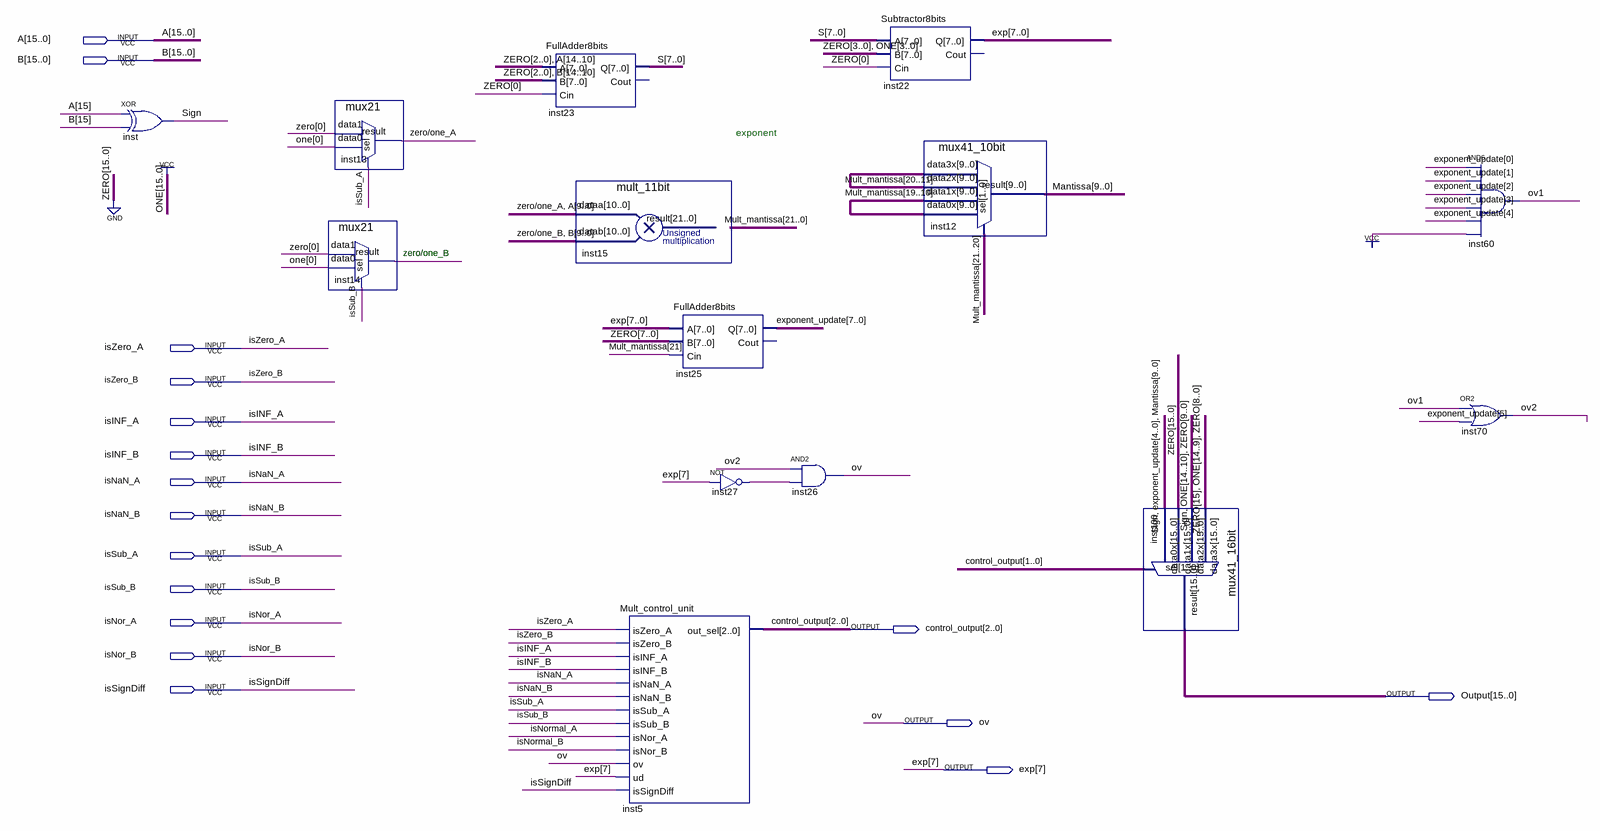
[diagram p0: schematic sheet]
// Quartus schematic Multiplies.bdf as structural Verilog: 14 symbols, 17 pins
module Multiplies (
  input  [15:0] A,
  input  [15:0] B,
  input  isZero_A,
  input  isZero_B,
  input  isINF_A,
  input  isINF_B,
  input  isNaN_A,
  input  isNaN_B,
  input  isSub_A,
  input  isSub_B,
  input  isNor_A,
  input  isNor_B,
  input  isSignDiff,
  output [2:0] control_output,
  output [15:0] Output,
  output ov,
  output [7:0] exp
);

  wire inst27_out, isNormal_A, isNormal_B, ov1, ov2, Sign, \zero/one_A , \zero/one_B ;
  wire [7:0] exponent_update, S;
  wire [9:0] Mantissa;
  wire [21:0] Mult_mantissa;

  xor inst (Sign, A[15], B[15]);
  mux21 inst13 (.data1(1'b0), .data0(1'b1), .sel(isSub_A), .result(\zero/one_A ));
  mux21 inst14 (.data1(1'b0), .data0(1'b1), .sel(isSub_B), .result(\zero/one_B ));
  FullAdder8bits inst23 (.A({3'b000, A[14:10]}), .B({3'b000, B[14:10]}), .Cin(1'b0), .Q(S));  // open: Cout
  mult_11bit inst15 (.dataa({\zero/one_A , A[9:0]}), .datab({\zero/one_B , B[9:0]}), .result(Mult_mantissa));
  Mult_control_unit inst5 (
    .isZero_A(isZero_A), .isZero_B(isZero_B), .isINF_A(isINF_A), .isINF_B(isINF_B), .isNaN_A(isNaN_A),
    .isNaN_B(isNaN_B), .isSub_A(isSub_A), .isSub_B(isSub_B), .isNor_A(isNormal_A), .isNor_B(isNormal_B),
    .ov(ov), .ud(exp[7]), .isSignDiff(isSignDiff), .out_sel(control_output));
  FullAdder8bits inst25 (.A(exp), .B({8{1'b0}}), .Cin(Mult_mantissa[21]), .Q(exponent_update));  // open: Cout
  not inst27 (inst27_out, exp[7]);
  and inst26 (ov, ov2, inst27_out);
  Subtractor8bits inst22 (.A(S), .B(8'b00001111), .Cin(1'b0), .Q(exp));  // open: Cout
  mux41_10bit inst12 (
    .data3x(Mult_mantissa[20:11]), .data2x(Mult_mantissa[20:11]), .data1x(Mult_mantissa[19:10]),
    .data0x(Mult_mantissa[19:10]), .sel(Mult_mantissa[21:20]), .result(Mantissa));
  mux41_16bit inst100 (
    .data3x(16'b0111111000000000), .data2x({Sign, 15'b111110000000000}), .data1x({16{1'b0}}),
    .data0x({Sign, exponent_update[4:0], Mantissa}), .sel(control_output[1:0]), .result(Output));
  and inst60 (ov1, exponent_update[0], exponent_update[1], exponent_update[2], exponent_update[3], exponent_update[4], 1'b1);
  or inst70 (ov2, ov1, exponent_update[5]);

  // Notes on the sheet:
  //   exponent
  //   zero/one_B
endmodule
